# EAGLE design H1AR30 (EAGLE 9.3.0)

## Sheet 1 of 2
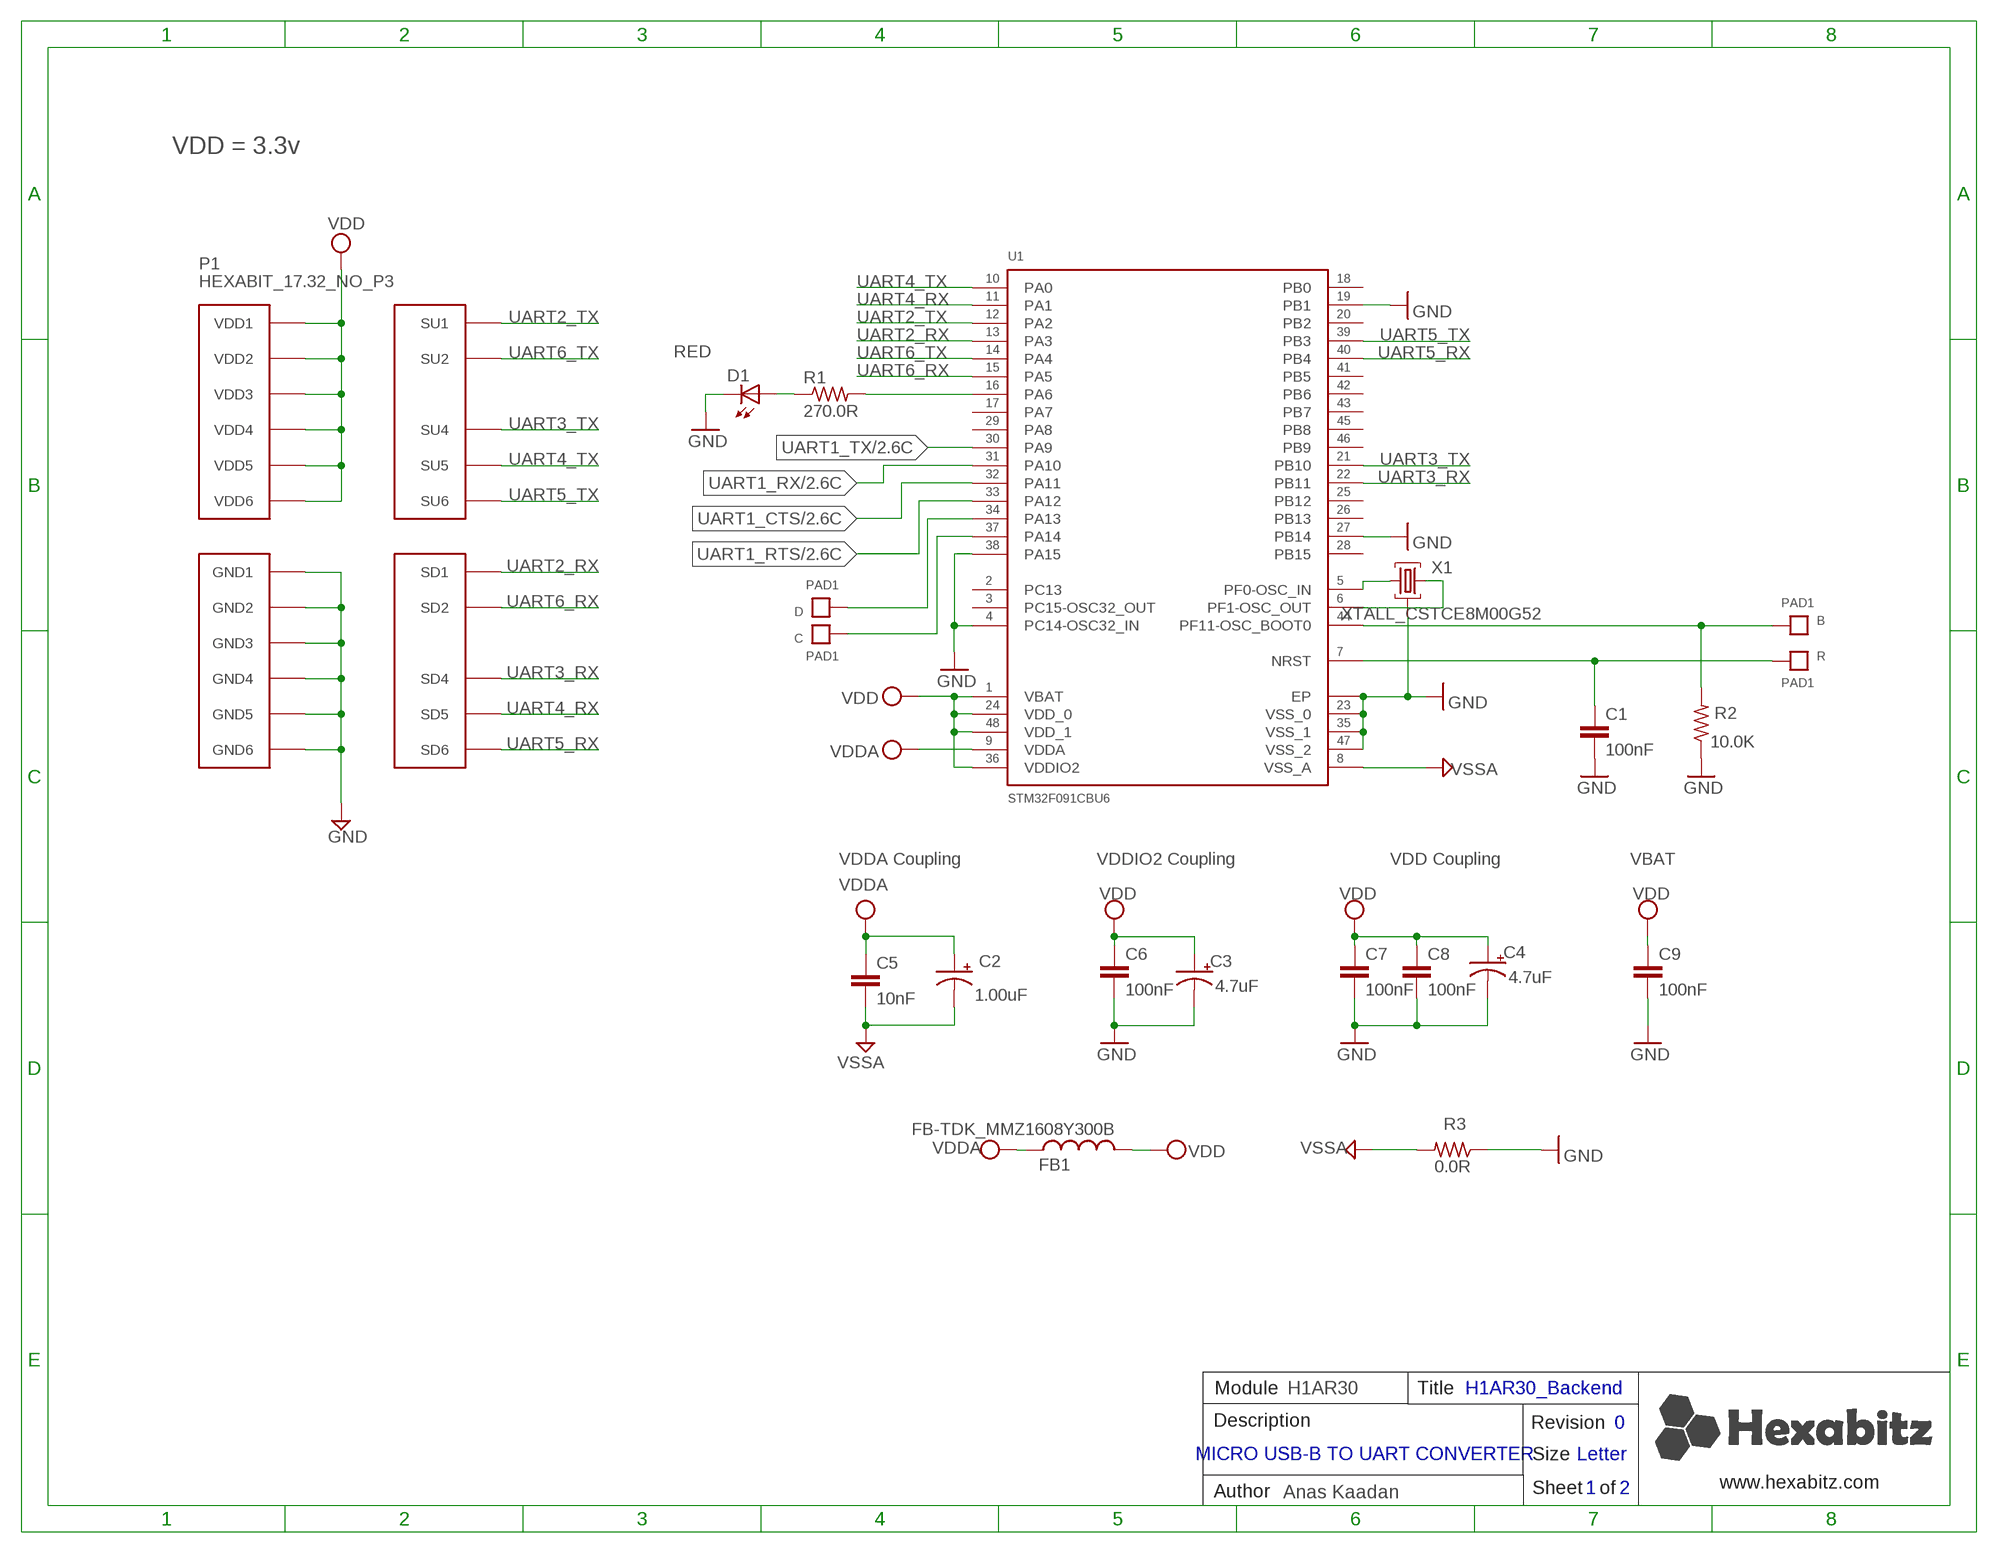
[diagram p0: schematic, sheet 1]

### Parts
B  PAD1  [PAD1]
C  PAD1  [PAD1]
C1  100nF  C-0603  [C-0603]
C2  1.00uF  C-0805-POL  [C-0805-POL]
C3  4.7uF  C-0805-POL  [C-0805-POL]
C4  4.7uF  C-0805-POL  [C-0805-POL]
C5  10nF  C-0603  [C-0603]
C6  100nF  C-0603  [C-0603]
C7  100nF  C-0603  [C-0603]
C8  100nF  C-0603  [C-0603]
C9  100nF  C-0603  [C-0603]
D  PAD1  [PAD1]
D1  RED  VLMS1300-GS08  [VLMS1300-GS08]
FB1  FB-TDK_MMZ1608Y300B  [FB-TDK_MMZ1608Y300B]
P1  HEXABIT_17.32_NO_P3  [HEXABIT_17.32_NO_P3]
R  PAD1  [PAD1]
R1  270.0R  R-0603  [R-0603]
R2  10.0K  R-0603  [R-0603]
R3  0.0R  R-0603  [R-0603]
U1  STM32F091CBU6  [STM32F091CBU6]
X1  XTALL_CSTCE8M00G52  [XTALL_CSTCE8M00G52]

### Nets
B1: B.P$1 B.P$2 R2.2 U1.P$44(PF11-OSC_BOOT0)
GND: C1.2 C3.2(-) C4.2(-) C6.2 C7.2 C8.2 C9.2 D1.C P1.PAD_PD7(GND1) P1.PAD_PD8(GND2) P1.PAD_PD9(GND3) P1.PAD_PD10(GND4) P1.PAD_PD11(GND5) P1.PAD_PD12(GND6) R2.1 R3.1 U1.EP U1.P$3(PC14-OSC32_IN) U1.P$19(PB1) U1.P$23(VSS_0) U1.P$27(PB14) U1.P$35(VSS_1) U1.P$38(PA15) U1.P$47(VSS_2) X1.P$2 ; also sheet 2
N$1: R1.2 U1.P$16(PA6)
N$4: D1.A R1.1
N$5: U1.P$5(PF0-OSC_IN) X1.P$1
N$6: U1.P$6(PF1-OSC_OUT) X1.P$3
N$7: D.P$1 D.P$2 U1.P$34(PA13)
N$9: C.P$1 C.P$2 U1.P$37(PA14)
R1: C1.1 R.P$1 R.P$2 U1.P$7(NRST)
UART1_CTS: U1.P$32(PA11) ; also sheet 2
UART1_RTS: U1.P$33(PA12) ; also sheet 2
UART1_RX: U1.P$31(PA10) ; also sheet 2
UART1_TX: U1.P$30(PA9) ; also sheet 2
UART2_RX: P1.PAD_PD1(SD1) U1.P$13(PA3)
UART2_TX: P1.PAD_PU1(SU1) U1.P$12(PA2)
UART3_RX: P1.PAD_PD4(SD4) U1.P$22(PB11)
UART3_TX: P1.PAD_PU4(SU4) U1.P$21(PB10)
UART4_RX: P1.PAD_PD5(SD5) U1.P$11(PA1)
UART4_TX: P1.PAD_PU5(SU5) U1.P$10(PA0)
UART5_RX: P1.PAD_PD6(SD6) U1.P$40(PB4)
UART5_TX: P1.PAD_PU6(SU6) U1.P$39(PB3)
UART6_RX: P1.PAD_PD2(SD2) U1.P$15(PA5)
UART6_TX: P1.PAD_PU2(SU2) U1.P$14(PA4)
VDD: C3.1(+) C4.1(+) C6.1 C7.1 C8.1 C9.1 FB1.2 P1.PAD_PU7(VDD1) P1.PAD_PU8(VDD2) P1.PAD_PU9(VDD3) P1.PAD_PU10(VDD4) P1.PAD_PU11(VDD5) P1.PAD_PU12(VDD6) U1.P$1(VBAT) U1.P$24(VDD_0) U1.P$36(VDDIO2) U1.P$48(VDD_1) ; also sheet 2
VDDA: C2.1(+) C5.1 FB1.1 U1.P$9(VDDA)
VSSA: C2.2(-) C5.2 R3.2 U1.P$8(VSS_A)
Unconnected: U1.P$2(PC13) U1.P$4(PC15-OSC32_OUT) U1.P$17(PA7) U1.P$18(PB0) U1.P$20(PB2) U1.P$25(PB12) U1.P$26(PB13) U1.P$28(PB15) U1.P$29(PA8) U1.P$41(PB5) U1.P$42(PB6) U1.P$43(PB7) U1.P$45(PB8) U1.P$46(PB9)

### Notes on the sheet
- VDD = 3.3v
- VDDA Coupling | VDDIO2 Coupling | VDD Coupling | VBAT
- Module | H1AR30 | Title | H1AR30_Backend
- Description | Revision | 0
- MICRO USB-B TO UART CONVERTER
- Size | Letter
- www.hexabitz.com
- Author | Anas Kaadan | Sheet   of | 1 | 2
- C:/Users/Admin/Desktop/logodraft.bmp

## Sheet 2 of 2
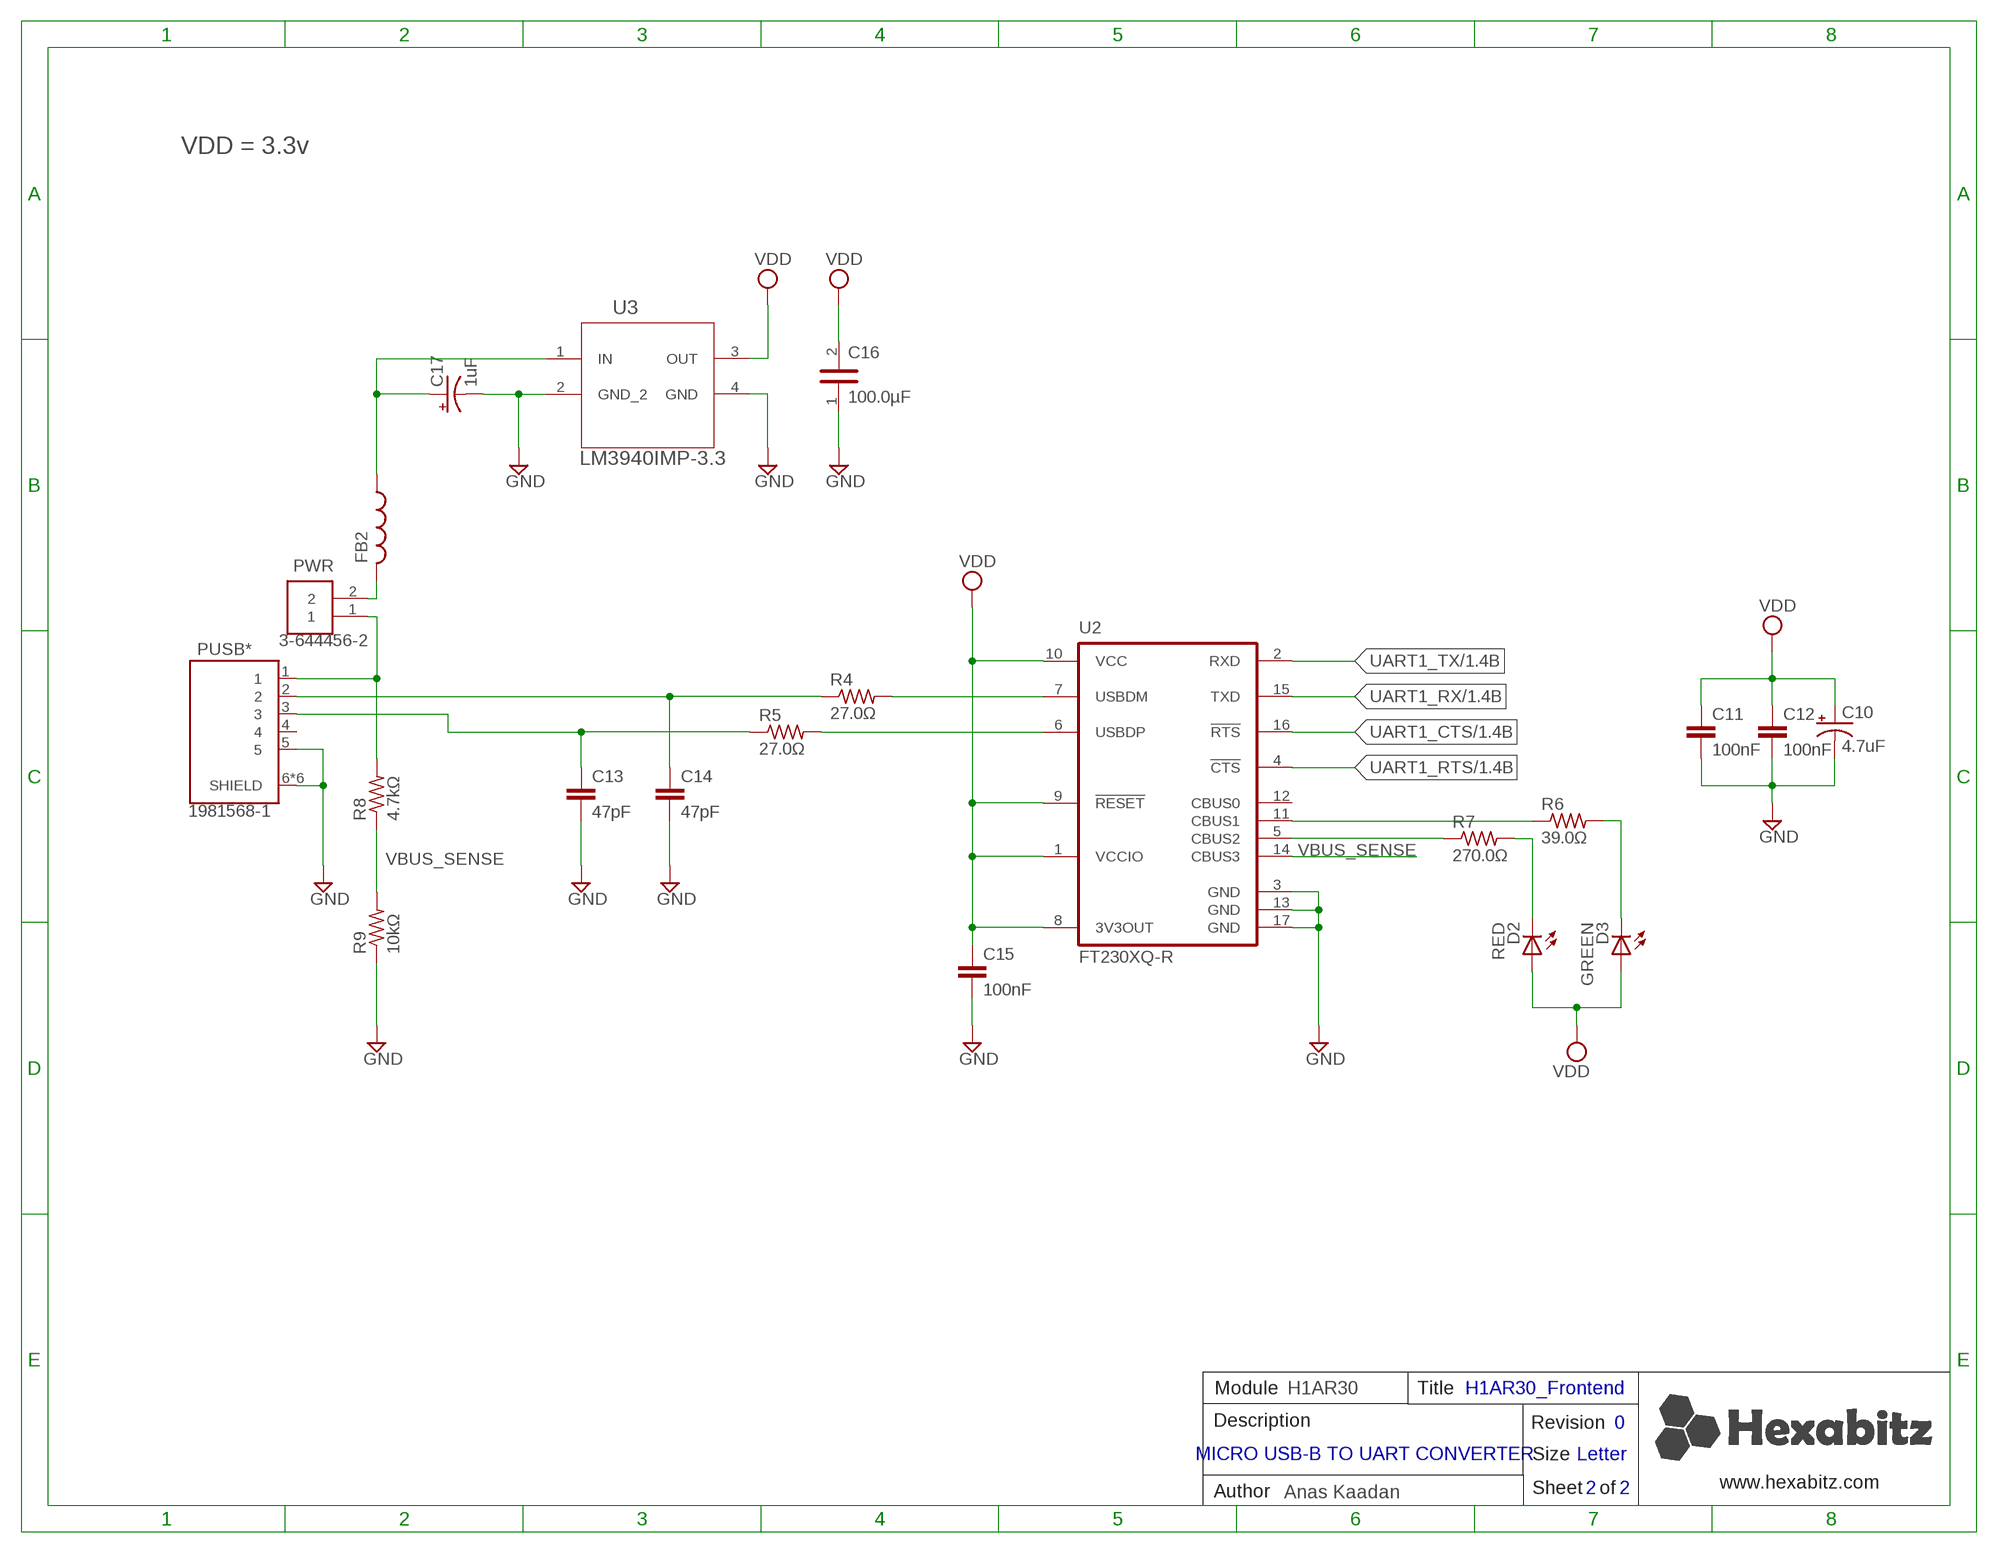
[diagram p1: schematic, sheet 2]

### Parts
C10  4.7uF  C-0805-POL  [C-0805-POL]
C11  100nF  C-0603  [C-0603]
C12  100nF  C-0603  [C-0603]
C13  47pF  C-0603  [C-0603]
C14  47pF  C-0603  [C-0603]
C15  100nF  C-0603  [C-0603]
C16  100uF  C-3225TDK_C3225X5R0J107M250AC_0_0  [C-3225]
C17  1uF  C-0805-POL  [C-0805-POL]
D2  RED  VLMS1300-GS08  [VLMS1300-GS08]
D3  GREEN  VLMTG1300-GS08  [VLMS1300-GS08]
FB2  FB-TDK_MMZ1608Y300B  [FB-TDK_MMZ1608Y300B]
PUSB*  1981568-1  [TE_1981568-1]
PWR  3-644456-2  [TE_3-644456-2]
R4  27.0Ω  R-0603  [R-0603]
R5  27.0Ω  R-0603  [R-0603]
R6  39.0Ω  R-0603  [R-0603]
R7  270.0Ω  R-0603  [R-0603]
R8  4.7kΩ  R-0603  [R-0603]
R9  10kΩ  R-0603  [R-0603]
U2  FT230XQ-R  [QFN16]
U3  LM3940IMP-3.3  [SOT230P696X180-4N]

### Nets
GND: C10.2(-) C11.2 C12.2 C13.2 C14.2 C15.2 C16.1 C17.2(-) PUSB*.5 PUSB*.6(SHIELD) PUSB*.7(SHIELD) PUSB*.8(SHIELD) PUSB*.9(SHIELD) PUSB*.10(SHIELD) PUSB*.11(SHIELD) R9.1 U2.3(GND) U2.13(GND) U2.17(GND) U3.2(GND_2) U3.4(GND) ; also sheet 1
N$2: C14.1 PUSB*.2 R4.1
N$3: C13.1 PUSB*.3 R5.1
N$10: FB2.2 PWR.2
N$11: C17.1(+) FB2.1 U3.1(IN)
N$12: R5.2 U2.6(USBDP)
N$13: R4.2 U2.7(USBDM)
N$14: R7.1 U2.5(CBUS2)
N$15: R6.1 U2.11(CBUS1)
N$16: D2.C R7.2
N$17: D3.C R6.2
N$18: PUSB*.1 PWR.1 R8.2
UART1_CTS: U2.16(!RTS!) ; also sheet 1
UART1_RTS: U2.4(!CTS!) ; also sheet 1
UART1_RX: U2.15(TXD) ; also sheet 1
UART1_TX: U2.2(RXD) ; also sheet 1
VBUS_SENSE: R8.1 R9.2 U2.14(CBUS3)
VDD: C10.1(+) C11.1 C12.1 C15.1 C16.2 D2.A D3.A U2.1(VCCIO) U2.8(3V3OUT) U2.9(!RESET!) U2.10(VCC) U3.3(OUT) ; also sheet 1
Unconnected: PUSB*.4 U2.12(CBUS0)

### Notes on the sheet
- VDD = 3.3v
- Module | H1AR30 | Title | H1AR30_Frontend
- Description | Revision | 0
- MICRO USB-B TO UART CONVERTER
- Size | Letter
- www.hexabitz.com
- Author | Anas Kaadan | Sheet   of | 2 | 2

## Library data of the parts
B C D R = Hexabitz:PAD1
C1 C6 C8 = Hexabitz:C-0603: CAP CER 10% X7R 0603; CAPACITANCE: 100nF; MFN: KEMET; MPN: C0603C104K8RACTU; OCTOPART_URL: https://octopart.com/c0603c104k8ractu-kemet-145075?r=sp&s=9bS9ASSwSEqMCE9KBEQZ0g; TOLERANCE: 10%; VOLTAGE_RATING: 10V
C2 = Hexabitz:C-0805-POL: Cap Tant Solid SMD 2012; CAPACITANCE: 1.00uF; MFN: Yageo; MPN: CC0805KKX7R7BB105; OCTOPART_URL: https://octopart.com/cc0805kkx7r7bb105-yageo-8376555?r=sp&s=YKl1wwtkROau_X5nniH2ig; TOLERANCE: 10%; VOLTAGE_RATING: 16V
C3 C4 = Hexabitz:C-0805-POL: Cap Tant Solid SMD 2012; CAPACITANCE: 4.7uF; MFN: Murata; MPN: GRM21BC81E475KA12L; OCTOPART_URL: https://octopart.com/grm21bc81e475ka12l-murata-10331911?r=sp&s=RY3qZSD8T6mG6TC9CHI5qQ; TOLERANCE: 10%; VOLTAGE_RATING: 25V
C5 = Hexabitz:C-0603: CAP CER 10% X7R 0603; CAPACITANCE: 10nF; MFN: KEMET; MPN: C0603C103K5RACTU; OCTOPART_URL: https://octopart.com/c0603c103k5ractu-kemet-133094?r=sp&s=R_iPBxLnSmGqhkU2rIMFpg; TOLERANCE: 10%; VOLTAGE_RATING: 50V
C7 = Hexabitz:C-0603: CAP CER 10% X7R 0603; CAPACITANCE: 100nF; MFN: KEMET; MPN: C0603C104K8RACTU; OCTOPART_URL: https://octopart.com/c0603c104k8ractu-kemet-145075?r=sp&s=9bS9ASSwSEqMCE9KBEQZ0g; TOLERANCE: 10%; VOLTAGE_RATING: 10
C9 = Hexabitz:C-0603: CAP CER 10% X7R 0603; CAPACITANCE: 100nF; MFN: KEMET; MPN: C0603C104K8RACTU; OCTOPART_URL: https://octopart.com/c0603c104k8ractu-kemet-145075?r=sp&s=9bS9ASSwSEqMCE9KBEQZ0g; TOLERANCE: 10V; VOLTAGE_RATING: 10%
C10 = Hexabitz:C-0805-POL: Cap Tant Solid SMD 2012; CAPACITANCE: 4.7 µF; MFN: Panasonic; MPN: 10TPU4R7MSI; OCTOPART_URL: https://octopart.com/10tpu4r7msi-panasonic-29487748; TOLERANCE: ±20%; VOLTAGE_RATING: 10.0 V
C11 C12 C15 = Hexabitz:C-0603: CAP CER 10% X7R 0603; CAPACITANCE: 100 nF; MFN: AVX; MPN: 0603YC104K4T2A; OCTOPART_URL: https://octopart.com/0603yc104k4t2a-avx+interconnect+%2F+elco-8120651; TOLERANCE: ±10%; VOLTAGE_RATING: 16.0 V
C13 = Hexabitz:C-0603: CAP CER 10% X7R 0603; CAPACITANCE: 47 pF; MFN: AVX; MPN: 06035A470JAT2A; OCTOPART_URL: https://octopart.com/c3225x5r0j107m250ac-tdk-25947844?r=spc#; TOLERANCE: ±5%; VOLTAGE_RATING: 50.0 V
C14 = Hexabitz:C-0603: CAP CER 10% X7R 0603; CAPACITANCE: 47 pF; MFN: AVX; MPN: 06035A470JAT2A; OCTOPART_URL: https://octopart.com/06035a470jat2a-avx+interconnect+%2F+elco-46507018; TOLERANCE: ±5%; VOLTAGE_RATING: 50.0 V
C16 = Hexabitz:C-3225: 100µF ±20% 6.3V Ceramic Capacitor X5R 1210 (3225 Metric); CAPACITANCE: 100.0µF; DESCRIPTION: CAP CER 100UF 6.3V X5R 1210; MFN: TDK; MPN: C3225X5R0J107M250AC; OCTOPART_URL: https://octopart.com/c3225x5r0j107m250ac-tdk-25947844?r=spc#; PACKAGE: 1210 (3225 metric); TEMPERATURE_RANGE_HIGH: +85°C; TEMPERATURE_RANGE_LOW: -55°C; VOLTAGE: 6.3V
C17 = Hexabitz:C-0805-POL: Cap Tant Solid SMD 2012; CAPACITANCE: 1.00 µF; MFN: AVX; MPN: TAJR105M016RNJ; OCTOPART_URL: http://octopart.com/tajr105m016rnj-avx-1188552; TOLERANCE: ±20%; VOLTAGE_RATING: 16.0 V
D1 = Hexabitz:VLMS1300-GS08: Red 0603 130° Clear 54 mcd 2 V Surface Mount ChipLED ; Octopart Url : http://octopart.com/vlms1300-gs08-vishay-21709201; MFN: Vishay; MPN: VLMS1300-GS08; OCTOPART_URL: https://octopart.com/vlms1300-gs08-vishay-21709201?r=sp&s=_gcP4_q8T1SC6PJQPTQ9yA
D2 = Hexabitz:VLMS1300-GS08: Red 0603 130° Clear 54 mcd 2 V Surface Mount ChipLED ; Octopart Url : http://octopart.com/vlms1300-gs08-vishay-21709201; MFN: Vishay; MPN: VLMS1300-GS08; OCTOPART_URL: https://octopart.com/vlms1300-gs08-vishay-21709201?r=sp&s=0nXJNjGsSbWwqfqWlZv0EA
D3 = Hexabitz:VLMTG1300-GS08: LED Uni-Color Green 530nm 2-Pin Chip 0603(1608Metric) T/R; MFN: Vishay; MPN: VLMTG1300-GS08; OCTOPART_URL: https://octopart.com/vlmtg1300-gs08-vishay-21709202
FB1 = Hexabitz:FB-TDK_MMZ1608Y300B: Ferrite Beads Multi-Layer 30Ohm 25% 100MHz 1.5A 50mOhm DCR 0603; MFN: TDK; MPN: MMZ1608Y300B; OCTOPART_URL: https://octopart.com/mmz1608y300b-tdk-368280?r=sp&s=cd9_2ZEqQ9q9UNBuQgHAiA
FB2 = Hexabitz:FB-TDK_MMZ1608Y300B: Ferrite Beads Multi-Layer 30Ohm 25% 100MHz 1.5A 50mOhm DCR 0603; MFN: TDK; MPN: MMZ1608Y300B; OCTOPART_URL: https://octopart.com/mmz1608y300b-tdk-368280
P1 = hexabitz_connectors:HEXABIT_?_NO_P3: Hexabitz Hexagon Module Connector Hexagon side length = 17.32mm. The following ports are removed: P3
PUSB* = Hexabitz:1981568-1: CONN RCPT MICRO USB B R/A SMD; DESCRIPTION: USB - micro B USB 2.0 Receptacle Connector 5 Position Surface Mount, Right Angle; MFN: TE Connectivity; MPN: 19815681; OCTOPART_URL: https://www.te.com/usa-en/product-19815681.html?te_bu=Cor&te_type=disp&te_campaign=seda_glo_cor-seda-global-disp-prtnr-fy19-seda-model-bom-cta_sma-317_1&elqCampaignId=32493
PWR = Hexabitz:3-644456-2; AVAILABILITY: Unavailable; CENTERLINE_PITCH: 2.54 mm[.1 in]; COMMENT: 3-644456-2; DESCRIPTION: Connector Unshrouded Header HDR 2 Position 2.54mm Solder Straight Thru-Hole; EU_ROHS_COMPLIANCE: Compliant; MF: TE Connectivity; MP: 3-644456-2; NUMBER_OF_POSITIONS: 2; PACKAGE: None; PRICE: None; PRODUCT_TYPE: Connector; TE_PURCHASE_URL: https://www.te.com/usa-en/product-3-644456-2.html?te_bu=Cor&te_type=disp&te_campaign=seda_glo_cor-seda-global-disp-prtnr-fy19-seda-model-bom-cta_sma-317_1&elqCampaignId=32493
R1 = Hexabitz:R-0603: Thick Film Resistors - SMD 0603; MFN: Yageo; MPN: RC0603FR-07270RL; OCTOPART_URL: https://octopart.com/search?q=RC0603FR-07270RL&start=0; RESISTANCE: 270.0 Ohm; TOLERANCE: 1%
R2 = Hexabitz:R-0603: Thick Film Resistors - SMD 0603; MFN: Vishay; MPN: CRCW060310K0JNEB; OCTOPART_URL: https://octopart.com/crcw060310k0jneb-vishay+dale-46603268; RESISTANCE: 10.0K Ohm; TOLERANCE: 5%
R3 = Hexabitz:R-0603: Thick Film Resistors - SMD 0603; MFN: Yageo; MPN: RC0603JR-070RL; OCTOPART_URL: https://octopart.com/rc0603jr-070rl-yageo-1241539?r=sp&s=X2NteqRjRNWrnx42Y0aliA; RESISTANCE: 0.0 Ohm
R4 R5 = Hexabitz:R-0603: Thick Film Resistors - SMD 0603; MFN: Vishay; MPN: CRCW060327R0FKEA; OCTOPART_URL: https://octopart.com/crcw060327r0fkea-vishay-39833156; RESISTANCE: 27.0 Ω; TOLERANCE: ±1%
R6 = Hexabitz:R-0603: Thick Film Resistors - SMD 0603; MFN: Panasonic; MPN: ERJ-3GEYJ390V; OCTOPART_URL: https://octopart.com/erj-3geyj390v-panasonic-55422095; RESISTANCE: 39.0 Ω; TOLERANCE: ±5%
R7 = Hexabitz:R-0603: Thick Film Resistors - SMD 0603; MFN: Panasonic; MPN: ERJ-3GEYJ271V; OCTOPART_URL: https://octopart.com/erj-3geyj271v-panasonic-55560546; RESISTANCE: 270.0 Ω; TOLERANCE: ±5%
R8 = Hexabitz:R-0603: Thick Film Resistors - SMD 0603; MFN: Vishay; MPN: CRCW06034K70FKEA; OCTOPART_URL: http://octopart.com/crcw06034k70fkea-vishay-39455708; RESISTANCE: 4.7 kΩ; TOLERANCE: ±1%
R9 = Hexabitz:R-0603: Thick Film Resistors - SMD 0603; MFN: Vishay; MPN: CRCW060310K0JNEB; OCTOPART_URL: https://octopart.com/crcw060310k0jneb-vishay+dale-46603268; RESISTANCE: 10.0 kΩ; TOLERANCE: ±5%
U1 = Hexabitz:STM32F091CBU6: Description : ARM-based 32-bit MCU, CAN, 12 timers, ADC, DAC & Comm. Interface, 2 to 3.6 V, -40 to 85 degC, 48-Pin UFQFPN, RoHS, Tray ;Parameter : Ciiva URL : https://ciiva.com/part/STM32F091CBU6-20240708, CiivaID : 20240708, Clock Speed : 48000000.0 Hz, Lifecycle Status : Active, Mounting Style : Surface Mount, Number of Pins : 48, Octopart Url : https://octopart.com/stm32f091cbu6-stmicroelectronics-51988677, OctopartID : 5f4f955c32ec8088, RAM Memory Size : 32768 B, REACH SVHC Compliance : No SVHC, RoHS : Compliant,; MFN: STMicroelectronics; MPN: STM32F091CBU6; OCTOPART_URL: https://octopart.com/stm32f091cbu6-stmicroelectronics-51988677?r=sp&s=bU6fpgsrTZOxHyt7jkfh3w
U2 = Hexabitz:FT230XQ-R: USB to BASIC UART; DESCRIPTION: USB Bridge, USB to UART USB 2.0 UART Interface 16-QFN _4x4_; MFN: FTDI,; MPN: FT230XQ-R; OCTOPART_URL: https://octopart.com/ft230xq-r-ftdi-22061504?r=sp; PACKAGE: QFN-16 FTDI
U3 = Hexabitz:LM3940IMP-3.3: Low Dropout Regulator; DESCRIPTION: Linear Voltage Regulator IC 1 Output 1A SOT-223-4; MFN: Texas Instruments; MPN: LM3940IMP-3.3/NOPB; OCTOPART_URL: https://octopart.com/lm3940imp-3.3%2Fnopb-texas+instruments-24823014?r=sp; PACKAGE: SOT-223 Texas Instruments
X1 = Hexabitz:XTALL_CSTCE8M00G52: MURATA CSTCE8M00G52-R0 RESONATOR, SMD, 8MHZ ; Octopart Url : https://octopart.com/cstce8m00g52-r0-murata-7145559; MFN: Murata; MPN: CSTCE8M00G52Z-R0; OCTOPART_URL: https://octopart.com/cstce8m00g52z-r0-murata-17755941?r=sp&s=JDnNJnrHQhyS8Zk4ofFWXw

## Board
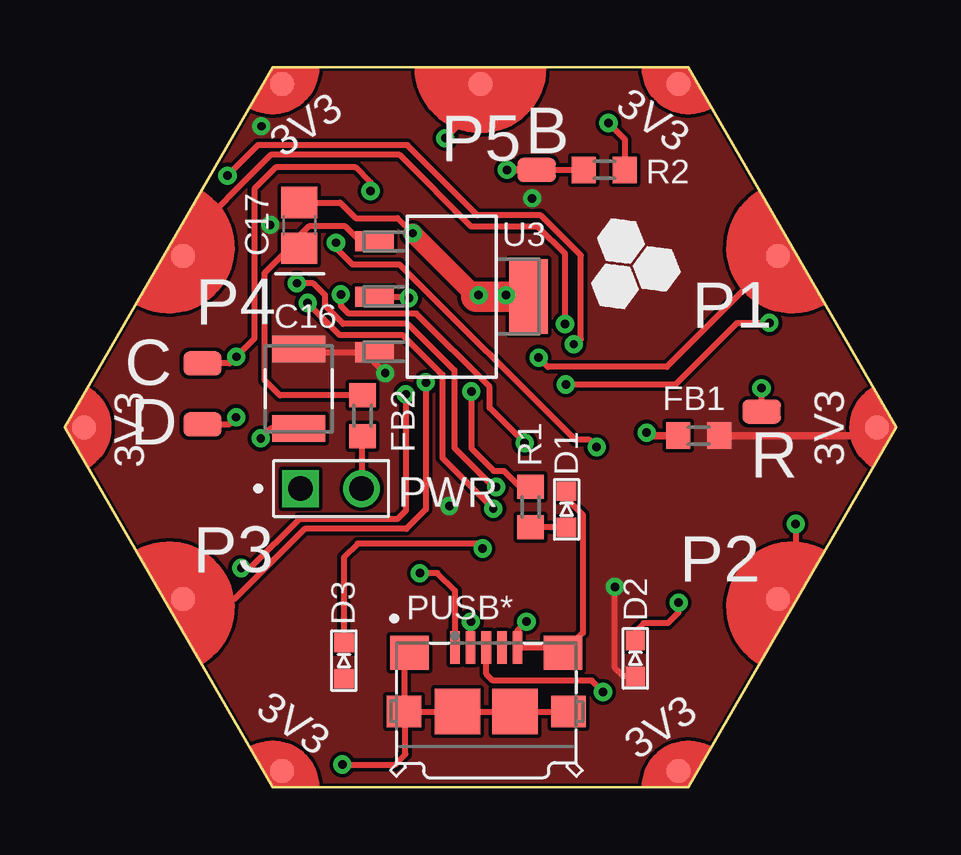
[diagram p2: board, top side]
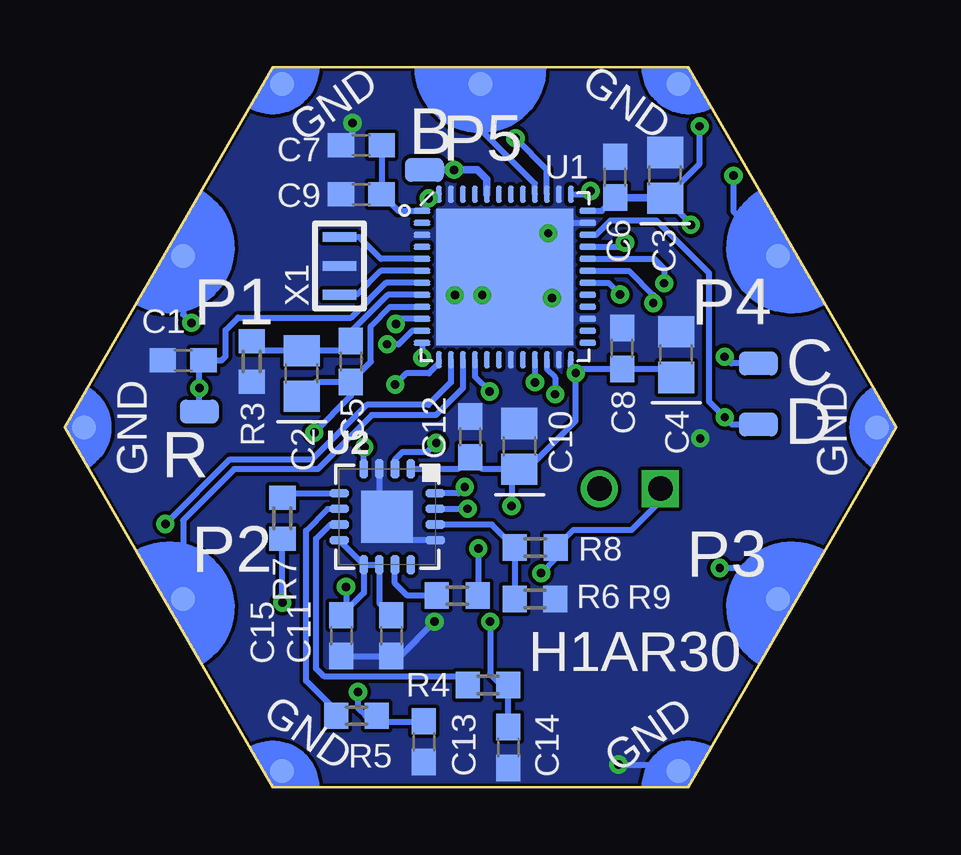
[diagram p3: board, bottom side, seen from below]

Size 34.64 x 30 mm. Coordinates in mm from the lower left corner, seen from the top.
Copper layers (1*16): Top 0.035mm / dielectric 1.5mm / Bottom 0.035mm
Design rules "2_layer": minimum track width 7mil, minimum drill 10mil, track to track 6mil, track to pad 6mil, pad to pad 6mil, via to via 6mil, smd to smd 0mil, copper to edge 1mil, drill to drill 8mil, minimum pad ring 10mil, minimum via ring 8mil, stop-mask expansion 2mil, vias tented up to drill 15mil, thermal gap 10mil

### Footprints (pad centres in the part's own frame; a part is rotated, then mirrored left to right if it is on the bottom)
PAD1 = smd 1.6 x 1: P$1 0,0 | smd 1.6 x 1 bottom: P$2 0,0
C-0603 = smd 1.1 x 1: 1 -0.85,0; 2 0.85,0
C-0805-POL = smd 1.3 x 1.5: 1 -0.95,0; 2 0.95,0
C-3225 = smd 1.1 x 2.2: 1 -1.65,0; 2 1.65,0
VLMS1300-GS08 = smd 0.8 x 0.8: A 0,0.75; C 0,-0.75
FB-TDK_MMZ1608Y300B = smd 1 x 1.1: 1 -0.85,0; 2 0.85,0
HEXABIT_17.32_NO_P3 = smd 1 x 1 bottom: PAD_PD1 12.39,7.15; PAD_PD2 12.39,-7.15; PAD_PD4 -12.39,-7.15; PAD_PD5 -12.39,7.15; PAD_PD6 0,14.31; PAD_PD7 8.26,14.31; PAD_PD8 16.52,0; PAD_PD9 8.26,-14.31; PAD_PD10 -8.26,-14.31; PAD_PD11 -16.52,0; PAD_PD12 -8.26,14.31 | smd 1 x 1: PAD_PU1 12.39,7.15; PAD_PU2 12.39,-7.15; PAD_PU4 -12.39,-7.15; PAD_PU5 -12.39,7.15; PAD_PU6 0,14.31; PAD_PU7 8.26,14.31; PAD_PU8 16.52,0; PAD_PU9 8.26,-14.31; PAD_PU10 -8.26,-14.31; PAD_PU11 -16.52,0; PAD_PU12 -8.26,14.31
TE_1981568-1 = smd 0.4 x 1.35: 1 -1.3,2.675; 2 -0.65,2.675; 3 0,2.675; 4 0.65,2.675; 5 1.3,2.675 | smd 1.6 x 1.4: 6 -3.2,2.45; 7 3.2,2.45 | smd 1.45 x 1.3: 8 3.425,0; 9 -3.425,0 | smd 1.9 x 1.9: 10 -1.2,0; 11 1.2,0
TE_3-644456-2 = drill 1.02 pad 1.37 square: 1 0,0 | drill 1.02 pad 1.37: 2 2.54,0
R-0603 = smd 1 x 1.1: 1 -0.85,0; 2 0.85,0
STM32F091CBU6 = smd 5.7 x 5.7: EP 0,0 | smd 0.25 x 0.7: P$1 -2.75,-3.45; P$2 -2.25,-3.45; P$3 -1.75,-3.45; P$4 -1.25,-3.45; P$5 -0.75,-3.45; P$6 -0.25,-3.45; P$7 0.25,-3.45; P$8 0.75,-3.45; P$9 1.25,-3.45; P$10 1.75,-3.45; P$11 2.25,-3.45; P$12 2.75,-3.45; P$25 2.75,3.45; P$26 2.25,3.45; P$27 1.75,3.45; P$28 1.25,3.45; P$29 0.75,3.45; P$30 0.25,3.45; P$31 -0.25,3.45; P$32 -0.75,3.45; P$33 -1.25,3.45; P$34 -1.75,3.45; P$35 -2.25,3.45; P$36 -2.75,3.45 | smd 0.7 x 0.25: P$13 3.45,-2.75; P$14 3.45,-2.25; P$15 3.45,-1.75; P$16 3.45,-1.25; P$17 3.45,-0.75; P$18 3.45,-0.25; P$19 3.45,0.25; P$20 3.45,0.75; P$21 3.45,1.25; P$22 3.45,1.75; P$23 3.45,2.25; P$24 3.45,2.75; P$37 -3.45,2.75; P$38 -3.45,2.25; P$39 -3.45,1.75; P$40 -3.45,1.25; P$41 -3.45,0.75; P$42 -3.45,0.25; P$43 -3.45,-0.25; P$44 -3.45,-0.75; P$45 -3.45,-1.25; P$46 -3.45,-1.75; P$47 -3.45,-2.25; P$48 -3.45,-2.75
QFN16 = smd 0.8 x 0.35: 1 -2,0.975; 2 -2,0.325; 3 -2,-0.325; 4 -2,-0.975; 9 2,-0.975; 10 2,-0.325; 11 2,0.325; 12 2,0.975 | smd 0.35 x 0.8: 5 -0.975,-2; 6 -0.325,-2; 7 0.325,-2; 8 0.975,-2; 13 0.975,2; 14 0.325,2; 15 -0.325,2; 16 -0.975,2 | smd 2.15 x 2.15: 17 0,0
SOT230P696X180-4N = smd 1.6 x 0.838: 1 -3.2,2.311; 2 -3.2,0; 3 -3.2,-2.311 | smd 1.6 x 3.099: 4 3.2,0
XTALL_CSTCE8M00G52 = smd 1.4 x 0.4: P$1 0,1.2; P$2 0,0; P$3 0,-1.2

### Placement (x,y rotation side)
B  19.66,25.73 0 top
C  5.74,17.67 0 top
C1  29.71,17.79 180 bottom
C2  24.78,17.24 90 bottom
C3  9.63,25.5 90 bottom
C4  9.17,18.03 90 bottom
C5  22.72,17.75 90 bottom
C6  11.71,25.43 90 bottom
C7  22.28,26.76 180 bottom
C8  11.41,18.29 90 bottom
C9  22.29,24.71 180 bottom
C10  15.69,14.21 90 bottom
C11  21.04,6.33 270 bottom
C12  17.74,14.61 90 bottom
C13  19.68,1.91 270 bottom
C14  16.16,1.67 270 bottom
C15  23.11,6.33 270 bottom
C16  9.75,16.61 90 top
C17  9.78,23.42 90 top
D  5.74,15.13 180 top
D1  20.91,11.59 180 top
D2  23.77,5.37 180 top
D3  11.63,5.28 180 top
FB1  26.41,14.66 0 top
FB2  12.41,15.48 270 top
P1  17.32,15 0 top
PUSB*  17.56,3.16 0 top
PWR  9.83,12.45 0 top
R  29.03,15.66 0 top
R1  19.41,11.68 90 top
R2  22.48,25.73 180 top
R3  26.85,17.74 90 bottom
R4  17,4.27 180 bottom
R5  22.49,2.99 180 bottom
R6  18.29,7.99 0 bottom
R7  25.58,11.22 270 bottom
R8  15.03,10 0 bottom
R9  15.05,7.85 180 bottom
U1  16.3,21.27 270 bottom
U2  21.21,11.28 270 bottom
U3  16.11,20.45 0 top
X1  23.2,21.73 0 bottom

### Tracks (layer width: path | path; a pad name or v marks a point on that pad's centre or on a via)
B1  (via drill 0.35)
  Top 0.254: B.P$1 R2.2
  Top 0.305: B.P$1 v18.42,25.73
  Bottom 0.305: U1.P$44 17.05,25.34 17.45,25.73 v18.42,25.73 B.P$1
GND  (via drill 0.35)
  Top 0.254: U3.2 14.28,20.45 v14.34,20.39 | C17.2 11.47,24.37 12.11,23.72 13.86,23.72 v14.5,23.09 | C16.1 8.58,14.96 v8.16,14.54 | v22.65,27.69 23.34,27 R2.1 | v14.5,23.09 | PUSB*.6 14.14,5.39 PUSB*.9 | PUSB*.9 PUSB*.10 PUSB*.11 PUSB*.8 | v11.57,0.95 13.76,0.95 14.2,1.39 14.2,3.1 PUSB*.9 | D1.C 20.91,12.03 21.59,11.35 21.59,6.44 PUSB*.7 20.54,5.84 PUSB*.5 18.86,6.53 v19.24,6.91
  Top 0.813: 17.14,20.45 v14.5,23.09
  Top 1.27: U3.4 17.14,20.45
  Bottom 0.254: v11.57,0.95 9.32,0.95 P1.PAD_PD10 | U1.EP 16.3,21.4 14.18,23.52 U1.P$35 | C7.2 22.65,27.24 v22.65,27.69 | C15.2 C11.2 20.67,5.48 v19.24,6.91 | U2.3 21.53,11.6 U2.17 20.23,10.3 U2.13
  other vias: 17.24,20.51 18.39,20.51
  pour Bottom (isolate 0.102, no thermals): 8.66,0 25.98,0 34.64,15 25.98,30 8.66,30 0,15
N$1  (via drill 0.35)
  Top 0.254: v16.94,16.5 16.94,14.12 17.87,13.19 18.3,13.19 18.96,12.53 R1.2
  Bottom 0.254: U1.P$16 17.55,17.11 v16.94,16.5
N$2  (via drill 0.35)
  Top 0.254: PUSB*.2 v16.91,6.9 v16.92,6.91
  Bottom 0.254: C14.1 R4.1 16.47,4.27 16.92,4.72 v16.92,6.91
N$3  (via drill 0.35)
  Top 0.254: v22.43,3.98 21.96,4.45 17.84,4.45 17.56,4.73 PUSB*.3
  Bottom 0.254: C13.1 19.67,2.74 21.4,2.74 R5.1 22.11,2.99 22.43,3.3 v22.43,3.98
N$4
  Top 0.254: D1.A R1.1
N$5
  Bottom 0.254: U1.P$5 21.47,22.02 22.38,22.93 X1.P$1
N$6
  Bottom 0.254: U1.P$6 21.47,21.52 22.46,20.53 X1.P$3
N$7  (via drill 0.35)
  Top 0.254: D.P$1 6.84,15.13 v7.14,15.43
  Bottom 0.254: U1.P$34 12.5,23.02 11.9,23.62 9.99,23.62 7.81,21.44 7.81,16.09 v7.14,15.43 6.84,15.13 D.P$1
N$9  (via drill 0.35)
  Top 0.254: v12.74,24.85 12.74,25.22 12.12,25.83 8.79,25.83 7.9,24.94 7.9,18.7 v7.15,17.95 6.87,17.67 C.P$1
  Bottom 0.254: U1.P$37 12.87,24.72 v12.74,24.85 | C.P$1 6.87,17.67 v7.15,17.95
N$10
  Top 0.254: FB2.2 12.37,14.59 PWR.2
N$11
  Top 0.254: U3.1 12.32,22.76 11.69,23.38 10.17,23.38 9.78,22.99 C17.1 9.36,22.47 8.33,21.44 8.33,16.97 8.96,16.33 FB2.1
N$12
  Bottom 0.254: U2.6 23.69,11.6 24.59,10.7 24.59,4.44 23.34,3.19 R5.2
N$13
  Bottom 0.254: R4.2 18.22,4.64 23.85,4.64 24.16,4.95 24.16,10.36 23.58,10.95 U2.7
N$14
  Bottom 0.254: R7.1 25.38,12.26 U2.5
N$15
  Bottom 0.254: R6.1 20.37,7.99 20.88,8.5 U2.11
N$16  (via drill 0.35)
  Top 0.254: v25.57,7.7 25.57,7.29 25.13,6.85 24.11,6.85 23.77,6.5 D2.C
  Bottom 0.254: v25.57,7.7 R7.2
N$17  (via drill 0.35)
  Top 0.254: v17.41,9.96 17.21,10.16 12.2,10.16 11.63,9.59 D3.C
  Bottom 0.254: v17.41,9.96 17.41,8.02 R6.2
N$18  (via drill 0.35)
  Top 0.254: PUSB*.1 16.26,8.2 15.53,8.93 v14.79,8.93
  Bottom 0.254: PWR.1 9.83,11.93 11.02,10.73 13.45,10.73 R8.2 14.18,9.54 v14.79,8.93
R1  (via drill 0.35)
  Top 0.254: R.P$1 v29.03,16.64
  Bottom 0.254: U1.P$7 21.26,21.02 22.71,19.57 27.42,19.57 27.94,19.05 27.94,17.96 28.11,17.79 C1.1 29.03,17.62 v29.03,16.64 R.P$1
UART1_CTS  (via drill 0.35)
  Top 0.254: v17.98,12.52 17.86,12.52 16.23,14.15 16.23,17.39 14.3,19.32 11.59,19.32 10.85,20.06 10.85,20.51 10.35,21.01 v9.67,21.01
  Bottom 0.254: U1.P$32 10.08,22.02 9.67,21.61 v9.67,21.01 | v17.98,12.52 18.24,12.25 U2.16
UART1_RTS  (via drill 0.35)
  Top 0.254: v11.3,22.7 11.3,22.48 11.99,21.79 13.94,21.79 21.26,14.48 21.87,14.48 v22.16,14.19
  Bottom 0.254: U1.P$33 11.48,22.52 v11.3,22.7 | U2.4 22.18,14.16 v22.16,14.19
UART1_RX  (via drill 0.35)
  Top 0.254: v10.12,20.18 11.44,18.86 14.07,18.86 15.73,17.2 15.73,13.73 v17.85,11.61
  Bottom 0.254: U1.P$31 11.13,21.52 10.12,20.51 v10.12,20.18 | U2.15 17.86,11.6 v17.85,11.61
UART1_TX  (via drill 0.35)
  Top 0.254: v19.16,14.35 17.7,15.81 17.7,16.69 14.65,19.74 11.83,19.74 11.5,20.07 v11.5,20.54
  Bottom 0.254: U1.P$30 11.98,21.02 v11.5,20.54 | U2.2 20.88,13.66 20.56,13.98 19.53,13.98 v19.16,14.35
UART2_RX  (via drill 0.35)
  Top 0.254: v20.88,16.79 25.46,16.79 28.03,19.36 v29.36,19.36
  Bottom 0.254: v20.88,16.79 20.42,17.25 19.47,17.25 19.05,17.67 U1.P$13 | v29.36,19.36 29.71,19.71 P1.PAD_PD1
UART2_TX  (via drill 0.35)
  Top 0.254: v19.75,17.91 20.13,17.53 25.09,17.53 P1.PAD_PU1
  Bottom 0.254: U1.P$12 v19.75,17.92 v19.75,17.91
UART3_RX  (via drill 0.35)
  Top 0.254: v14.21,16.38 14.21,11.53 13.85,11.18 9.76,11.18 7.73,9.14 v7.35,9.14
  Bottom 0.254: U1.P$22 14.55,17.43 14.21,17.08 v14.21,16.39 v14.21,16.38 | v7.35,9.14 6.23,9.14 P1.PAD_PD4
UART3_TX  (via drill 0.35)
  Top 0.254: P1.PAD_PU4 7.07,7.85 9.99,10.77 14.23,10.77 15.05,11.58 v15.05,16.88
  Bottom 0.254: U1.P$21 v15.05,16.89 v15.05,16.88
UART4_RX  (via drill 0.35)
  Top 0.254: v21.21,18.46 21.28,18.46 21.5,18.68 21.5,22.17 19.83,23.84 17.19,23.84 14.27,26.76 8.05,26.76 v6.78,25.49
  Bottom 0.254: U1.P$11 20.17,19.02 20.73,18.46 v21.21,18.46 | v6.78,25.49 6.78,24 P1.PAD_PD5
UART4_TX  (via drill 0.35)
  Top 0.254: v20.84,19.31 20.84,22.23 19.71,23.37 16.94,23.37 13.95,26.35 8.59,26.35 4.93,22.7 P1.PAD_PU5
  Bottom 0.254: U1.P$10 20.63,19.52 v20.84,19.31
UART5_RX
  Bottom 0.254: U1.P$40 15.05,25.15 17.32,27.42 P1.PAD_PD6
UART5_TX  (via drill 0.35)
  Top 0.254: v15.86,27.05 17.32,28.51 P1.PAD_PU6
  Bottom 0.254: U1.P$39 14.55,25.75 v15.86,27.05
UART6_RX
  Bottom 0.254: U1.P$15 18.05,16.64 19.18,15.51 21.85,15.51 24.1,13.26 27.58,13.26 29.71,11.13 P1.PAD_PD2
UART6_TX  (via drill 0.35)
  Top 0.254: v30.45,10.97 30.45,8.59 P1.PAD_PU2
  Bottom 0.254: U1.P$14 18.55,16.88 19.49,15.94 22.06,15.94 24.33,13.67 27.76,13.67 v30.45,10.97
VBUS_SENSE
  Bottom 0.254: U2.14 16.84,10.95 R8.1 15.88,7.86 R9.2
VDD  (via drill 0.35)
  Top 0.254: D2.A 23.29,4.62 22.9,5.02 22.9,8.33 v22.92,8.36 | v13.35,17.26 12.91,17.7 U3.3 9.88,18.14 C16.2
  Top 0.305: P1.PAD_PU8 33.5,14.66 FB1.2
  Bottom 0.254: v13.35,17.26 13.17,17.44 C8.1 9.53,17.44 C4.1 | C10.1 17.25,13.26 C12.1 18.22,13.28 U2.1 | C10.1 15.36,13.26 13.35,15.27 v13.35,17.26 | C11.1 21.53,7.67 U2.10 U2.9 | U2.9 22.18,8.11 C15.1 22.92,7.37 v22.92,8.36 | U2.9 U2.8 | v8.19,27.55 8.19,25.99 C3.1 8.55,23.48 v8.55,23.44 | U1.P$36 12.27,24.02 C6.1 | C10.1 16.02,12.93 v16.02,11.72 | v13.35,17.26 13.55,17.46 U1.P$24 | C7.1 C9.1 20.74,24.02 U1.P$1 19.47,24.3 v19.47,24.55 19.3,24.72 U1.P$48
  Bottom 0.305: C6.1 9.65,24.58 C3.1
  pour Top (isolate 0.102, no thermals): 8.66,0 25.98,0 34.64,15 25.98,30 8.66,30 0,15
VDDA  (via drill 0.35)
  Top 0.305: FB1.1 24.37,14.66 v24.24,14.78
  Bottom 0.254: C5.1 22.71,16.31 v24.24,14.78 | C5.1 21.88,17.74 21.88,19.22 21.09,20.02 U1.P$9 | C2.1 24.16,16.91 C5.1
VSSA
  Bottom 0.254: U1.P$8 21.17,20.52 22.71,18.98 C5.2 23.12,18.19 C2.2 26.45,18.19 R3.2

### Text on the board
tPlace: 3V3 | P5 | 3V3 | P4 | P1 | 3V3 | 3V3 | P3 | P2 | 3V3 | 3V3
bPlace: GND | GND | P5 | P4 | P1 | GND | GND | P2 | P3 | H1AR30 | GND | GND
bNames: B | C | D | R